# Altium schematic sheet MB.SchDoc
size A4
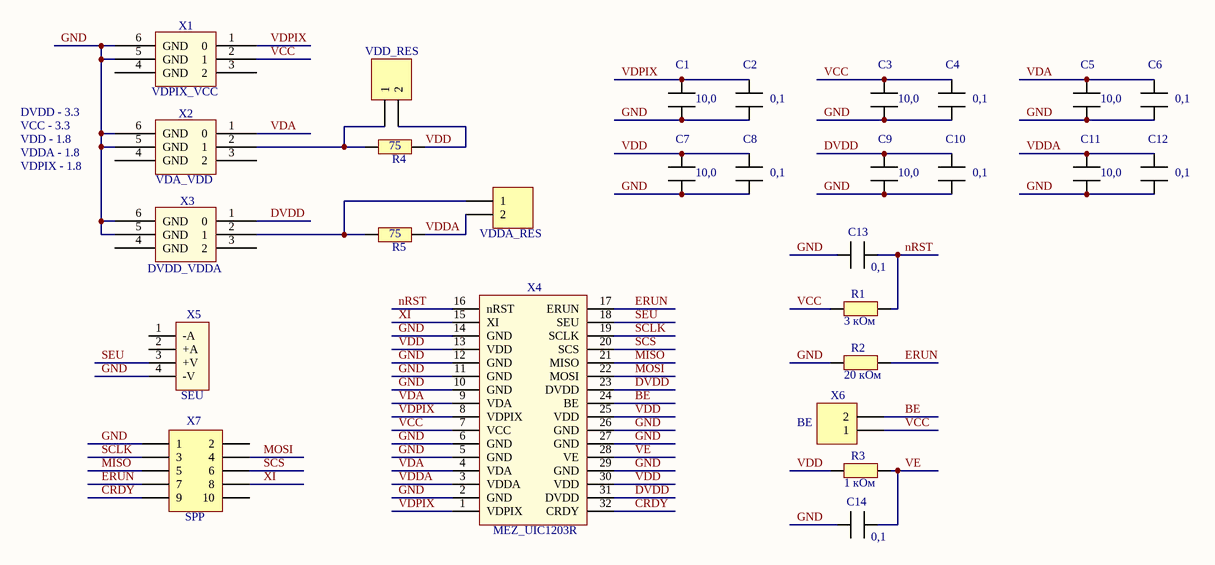
[diagram p0: MB.SchDoc]

## Parts
C1  10,0  [Cap_BIG]
C2  0,1  [CAP_SMALL]
C3  10,0  [Cap_BIG]
C4  0,1  [CAP_SMALL]
C5  10,0  [Cap_BIG]
C6  0,1  [CAP_SMALL]
C7  10,0  [Cap_BIG]
C8  0,1  [CAP_SMALL]
C9  10,0  [Cap_BIG]
C10  0,1  [CAP_SMALL]
C11  10,0  [Cap_BIG]
C12  0,1  [CAP_SMALL]
C13  0,1  [CAP_SMALL]
C14  0,1  [CAP_SMALL]
R1  3 кОм  [RES]
R2  20 кОм  [RES]
R3  1 кОм  [RES]
R4  75  [RES]
R5  75  [RES]
VDD_RES  Header 2  [HDR1X2]  (value not drawn)
VDDA_RES  Header 2  [HDR1X2]  (value not drawn)
X1  VDPIX_VCC  [POWER]
X2  VDA_VDD  [POWER]
X3  DVDD_VDDA  [POWER]
X4  MEZ_UIC1203R  [MEZ_UIC1203R]
X5  SEU  [AMP_VOLTMETER]
X6  BE  [HDR1X2]
X7  SPP  [HDR2X5]

## Nets
BE: X4.24(BE) X6.2
CRDY: X4.32(CRDY) X7.9
DVDD: C9.2 C10.2 X3.1(0) X4.23(DVDD) X4.31(DVDD)
ERUN: R2.2 X4.17(ERUN) X7.7
GND: C1.1 C2.1 C3.1 C4.1 C5.1 C6.1 C7.1 C8.1 C9.1 C10.1 C11.1 C12.1 C13.2 C14.2 R2.1 X1.5(GND) X1.6(GND) X2.5(GND) X2.6(GND) X3.5(GND) X3.6(GND) X4.2(GND) X4.5(GND) X4.6(GND) X4.10(GND) X4.11(GND) X4.12(GND) X4.14(GND) X4.26(GND) X4.27(GND) X4.29(GND) X5.4(-V) X7.1
MISO: X4.21(MISO) X7.5
MOSI: X4.22(MOSI) X7.4
nRST: C13.1 R1.2 X4.16(nRST)
SCLK: X4.19(SCLK) X7.3
SCS: X4.20(SCS) X7.6
SEU: X4.18(SEU) X5.3(+V)
VCC: C3.2 C4.2 R1.1 X1.2(1) X4.7(VCC) X6.1
VDA: C5.2 C6.2 X2.1(0) X4.4(VDA) X4.9(VDA)
VDD: C7.2 C8.2 R3.1 R4.2 VDD_RES.2 X4.13(VDD) X4.25(VDD) X4.30(VDD)
VDDA: C11.2 C12.2 R5.2 VDDA_RES.2 X4.3(VDDA)
VDPIX: C1.2 C2.2 X1.1(0) X4.1(VDPIX) X4.8(VDPIX)
VE: C14.1 R3.2 X4.28(VE)
XI: X4.15(XI) X7.8
NetR4_1: R4.1 VDD_RES.1 X2.2(1)
NetR5_1: R5.1 VDDA_RES.1 X3.2(1)

Not connected (* = marked no-connect by the designer): X1 3(2) 4(GND); X2 3(2) 4(GND); X3 3(2) 4(GND); X5 1(-A) 2(+A); X7 2 10

## Notes on the sheet
- DVDD - 3.3
- VCC - 3.3
- VDD - 1.8
- VDDA - 1.8
- VDPIX - 1.8

## Library data of the parts
C1 C3 C5 C7 C9 C11 = CAP_BIG
C2 C4 C6 C8 C10 C12-C14 = CAP_SMALL
R1-R5 = RES
VDD_RES VDDA_RES X6 = Header 2: Header, 2-Pin; LatestRevisionDate: 17-Jul-2002; LatestRevisionNote: Re-released for DXP Platform.; Publisher: Altium Limited
X1-X3 = POWER
X5 = AMP_VOLTMETER
X7 = Header 5X2: Header, 5-Pin, Dual row; LatestRevisionDate: 17-Jul-2002; LatestRevisionNote: Re-released for DXP Platform.; Publisher: Altium Limited